# Altium schematic sheet OptoD.SchDoc
size A4
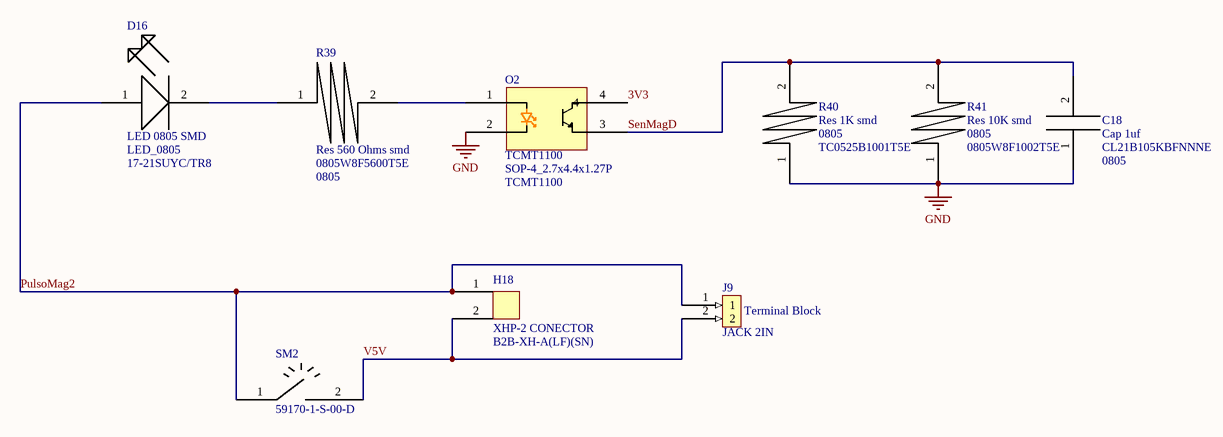
[diagram p0: OptoD.SchDoc]

## Parts
C18  Cap 1uf  MFR.Part #: CL21B105KBFNNNE  Package: 0805  [CAP 1UFSMD]
D16  LED 0805 SMD  Package: LED_0805  MFR.Part #: 17-21SUYC/TR8  [LED SMD Amarillo]
H18  XHP-2 CONECTOR  [CONECTOR 2 PINES]
J9  JACK 2IN  [Terminal Blocks 2in]
O2  TCMT1100  Package: SOP-4_2.7x4.4x1.27P  [TCMT110]
R39  Res 560 Ohms smd  MFR.Part #: 0805W8F5600T5E  Package: 0805  [RES 560]
R40  Res 1K smd  Package: 0805  MFR.Part #: TC0525B1001T5E  [RES 1K]
R41  Res 10K smd  Package: 0805  MFR.Part #: 0805W8F1002T5E  [RES 10K]
SM2  59170-1-S-00-D  [Switch Magnetico]

## Nets
GND: C18.1 O2.2 R40.1 R41.1
3V3: O2.4
PulsoMag2: D16.1 H18.1 J9.1 SM2.1
SenMagD: C18.2 O2.3 R40.2 R41.2
V5V: H18.2 J9.2 SM2.2
NetD16_2: D16.2 R39.1
NetO2_1: O2.1 R39.2

## Notes on the sheet
- (in symbol JACK 2IN) Terminal Block

## Library data of the parts
D16 = LED 0805 SMD: LED 0805 Yellow
H18 = B2B-XH-A(LF)(SN): CONECTOR JST-XH 2 PINES; SUPPLIER NUMBER PART: B2B-XH-A(LF)(SN)
J9 = JACK 2IN: Pluggable Terminal Blocks WR-TBL Mod312 5.08mm 2Pin Opn Hztl PCBHdr; Manufacturer: Wurth Electronics; Manufacturer Part Number: 691312510002; Current Rating: 20 A; Mounting Angle: Horizontal; Mounting Method: PCB; Number of Positions: 2 Position; Voltage Rating: 300 V; Supplier 1: Mouser; RoHS: RoHS Compliant; Category: Pluggable Terminal Blocks; Stock 1: 413; Pricing 1: 1=0.528, 10=0.499, 50=0.475, 100=0.453, 500=0.429, 1000=0.416 (AUD); Color: Green; Connection Method: -; Contact Plating: Tin; Housing Material: Polybutylene Terephthalate (PBT); Packaging: Bulk; Product: Headers; Series: WR-TBL; Termination Style: Through Hole; Brand: Wurth Electronics; Contact Material: Brass; Flammability Rating: UL 94 V-0; Pitch: 5.08 mm; Wire Gauge Range: -; Wire Orientation: Horizontal; RoHS - Mouser: Y; Minimum Order Quantity: 1; Reeling: False; ComponentLink1URL: http://www.mouser.com/ds/2/445/6913125100xx-537850.pdf; ComponentLink1Description: http://www.mouser.com/ds/2/445/6913125100xx-537850.pdf; Supplier Part Number 1: 710-691312510002
O2 = TCMT110: MFR.Part #: TCMT1100
R41 = Res 10K smd: 10K
SM2 = 59170-1-S-00-D: MFR.Part #: 59170-1-S-00-D; Package: SENSOR-SMD